# Altium schematic sheet Sheet1.SchDoc
size A4; SheetNumber: 1; SheetTotal: 1
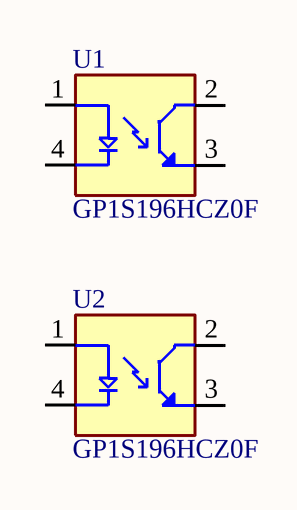
[diagram p0: Sheet1.SchDoc]

## Parts
U1  GP1S196HCZ0F  [OPTO_GP1S196HCZ0F]
U2  GP1S196HCZ0F  [OPTO_GP1S196HCZ0F]

## Nets

Not connected (* = marked no-connect by the designer): U1 1(A) 2(CT) 3(ET) 4(C); U2 1(A) 2(CT) 3(ET) 4(C)

## Library data of the parts
U1 U2 = GP1S196HCZ0F: Optical Sensor Through-Beam 0.043 (1.1mm) Phototransistor PCB Mount; MF: Sharp Microelectronics; Availability: Warning; Value: *; Check_prices: https://www.snapeda.com/parts/GP1S196HCZ0F/Sharp%20Microelectronics/view-part/2699849/?ref=eda; Package: PCB Mount Sharp; SnapEDA_Link: https://www.snapeda.com/parts/GP1S196HCZ0F/Sharp%20Microelectronics/view-part/2699849/?ref=snap; Price: None; MP: GP1S196HCZ0F; Purchase-URL: https://pricing.snapeda.com/search/part/GP1S196HCZ0F/?ref=eda